# Altium schematic sheet Template.SchDoc
size A4
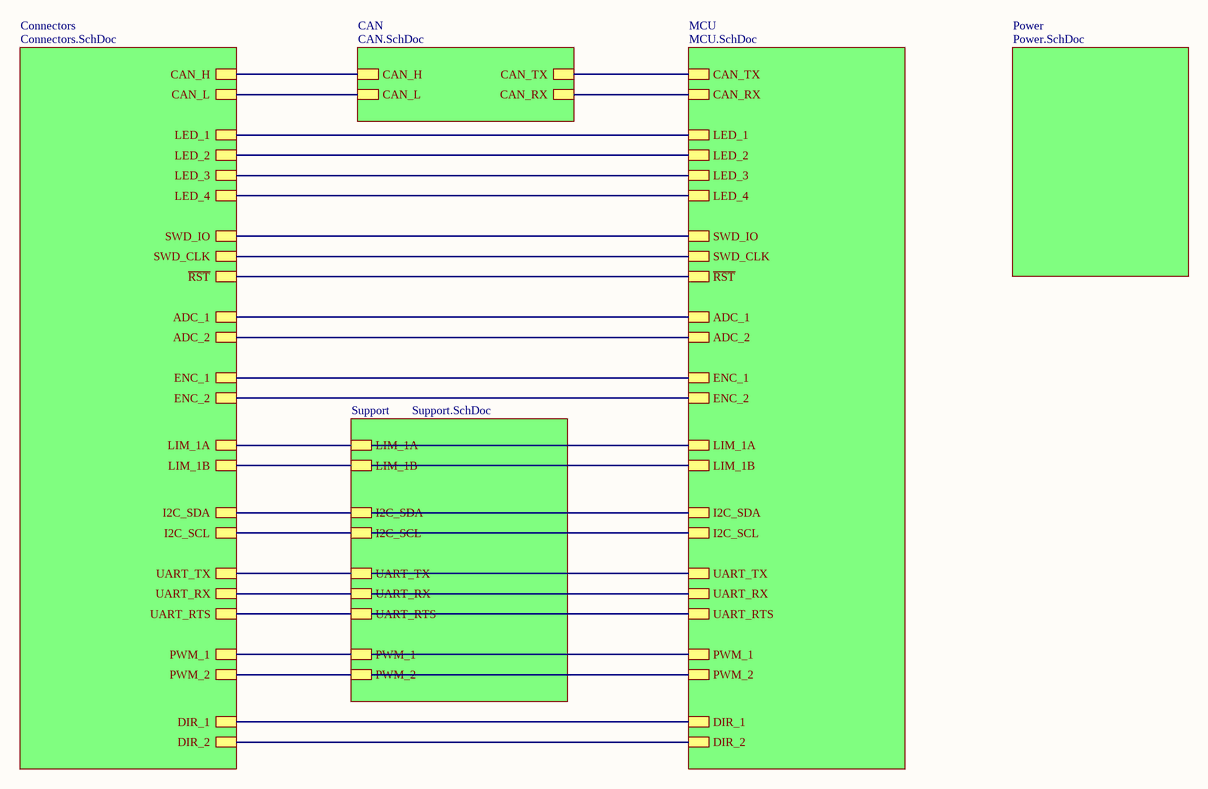
[diagram p0: Template.SchDoc]

## Sub-sheets
CAN = CAN.SchDoc: CAN_H, CAN_L, CAN_TX, CAN_RX
Connectors = Connectors.SchDoc: CAN_H, CAN_L, LED_1, LED_2, LED_3, LED_4, SWD_IO, SWD_CLK, ~{RST}, ADC_1, ADC_2, ENC_1, ENC_2, LIM_1A, LIM_1B, I2C_SDA, I2C_SCL, UART_TX, UART_RX, UART_RTS, PWM_1, DIR_2, DIR_1, PWM_2
MCU = MCU.SchDoc: CAN_TX, CAN_RX, LED_1, LED_2, LED_3, LED_4, SWD_IO, SWD_CLK, ~{RST}, ADC_1, ADC_2, ENC_1, ENC_2, LIM_1A, LIM_1B, I2C_SDA, I2C_SCL, UART_TX, UART_RX, UART_RTS, PWM_1, DIR_2, DIR_1, PWM_2
Power = Power.SchDoc: no entries
Support = Support.SchDoc: LIM_1A, LIM_1B, I2C_SDA, I2C_SCL, UART_TX, UART_RX, UART_RTS, PWM_1, PWM_2

## Nets
(unnamed): sheet Connectors/CAN_H, sheet CAN/CAN_H
(unnamed): sheet Connectors/CAN_L, sheet CAN/CAN_L
(unnamed): sheet Connectors/LED_1, sheet MCU/LED_1
(unnamed): sheet Connectors/LED_2, sheet MCU/LED_2
(unnamed): sheet Connectors/LED_3, sheet MCU/LED_3
(unnamed): sheet Connectors/LED_4, sheet MCU/LED_4
(unnamed): sheet Connectors/SWD_IO, sheet MCU/SWD_IO
(unnamed): sheet Connectors/SWD_CLK, sheet MCU/SWD_CLK
(unnamed): sheet Connectors/~{RST}, sheet MCU/~{RST}
(unnamed): sheet Connectors/ADC_1, sheet MCU/ADC_1
(unnamed): sheet Connectors/ADC_2, sheet MCU/ADC_2
(unnamed): sheet Connectors/ENC_1, sheet MCU/ENC_1
(unnamed): sheet Connectors/ENC_2, sheet MCU/ENC_2
(unnamed): sheet Connectors/LIM_1A, sheet Support/LIM_1A
(unnamed): sheet Connectors/LIM_1B, sheet Support/LIM_1B
(unnamed): sheet Connectors/I2C_SDA, sheet Support/I2C_SDA
(unnamed): sheet Connectors/I2C_SCL, sheet Support/I2C_SCL
(unnamed): sheet Connectors/UART_TX, sheet Support/UART_TX
(unnamed): sheet Connectors/UART_RX, sheet Support/UART_RX
(unnamed): sheet Connectors/UART_RTS, sheet Support/UART_RTS
(unnamed): sheet Connectors/PWM_1, sheet Support/PWM_1
(unnamed): sheet Connectors/DIR_2, sheet MCU/DIR_2
(unnamed): sheet Connectors/DIR_1, sheet MCU/DIR_1
(unnamed): sheet Connectors/PWM_2, sheet Support/PWM_2
(unnamed): sheet CAN/CAN_TX, sheet MCU/CAN_TX
(unnamed): sheet CAN/CAN_RX, sheet MCU/CAN_RX